# EAGLE design Adafruit NeoPixel 8 Stick (EAGLE 6.5.0)
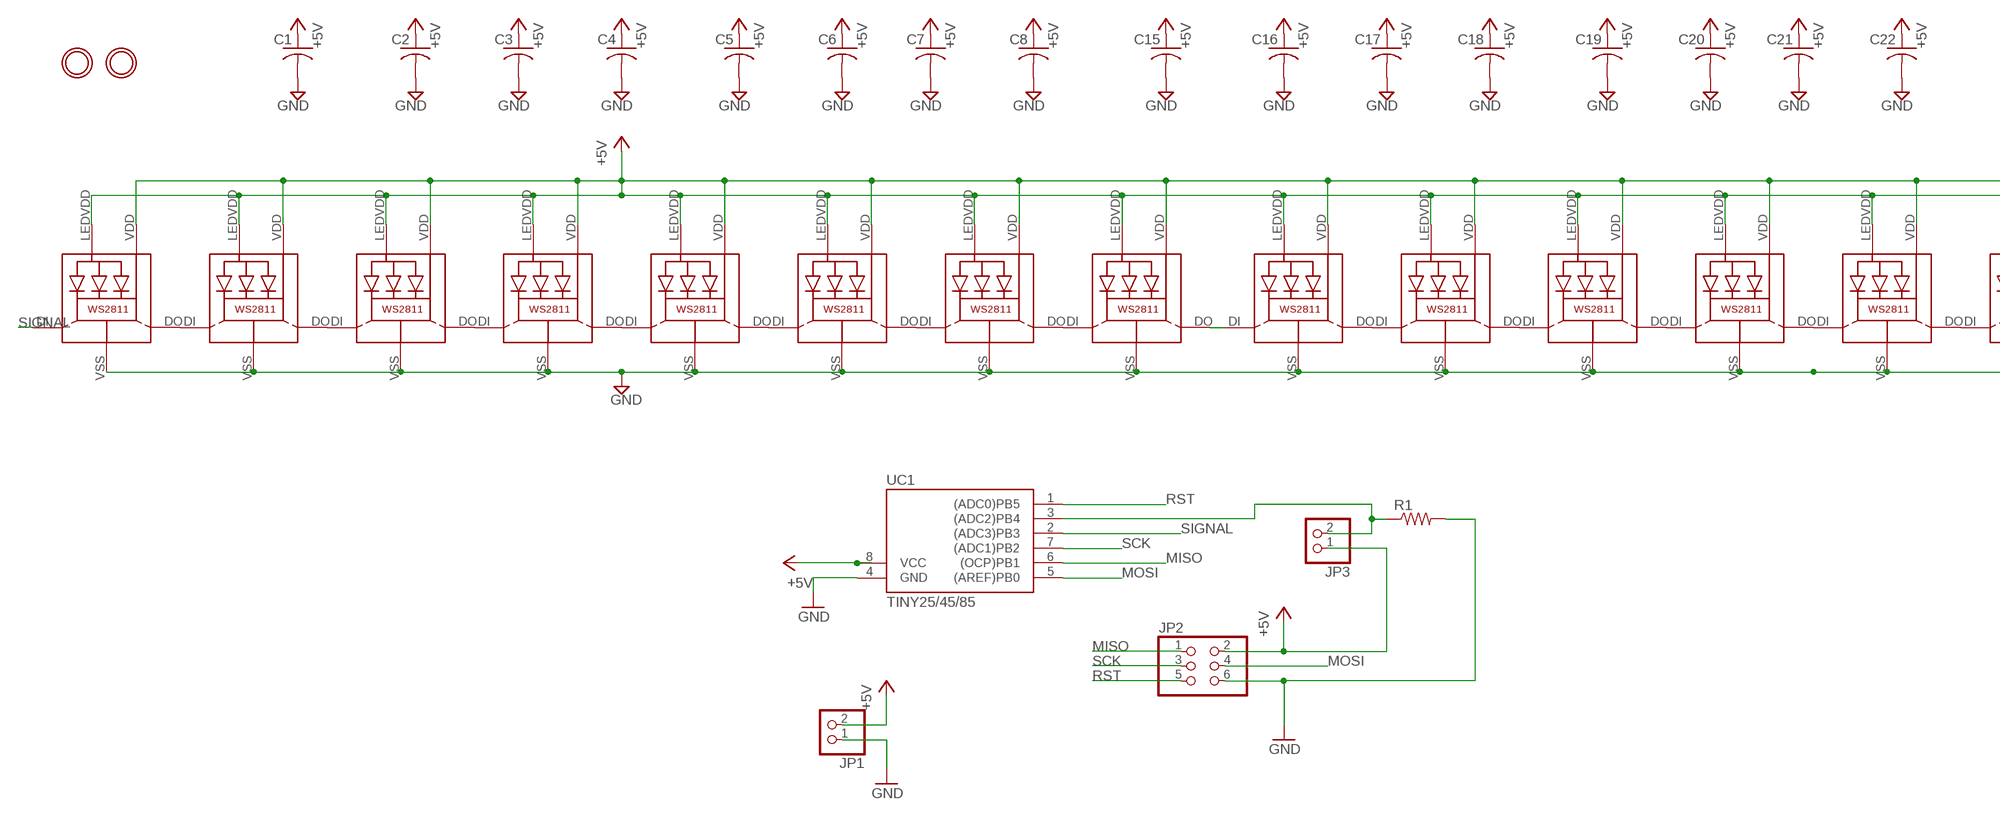
[diagram p0: schematic, sheet 1, part 1 of 2]
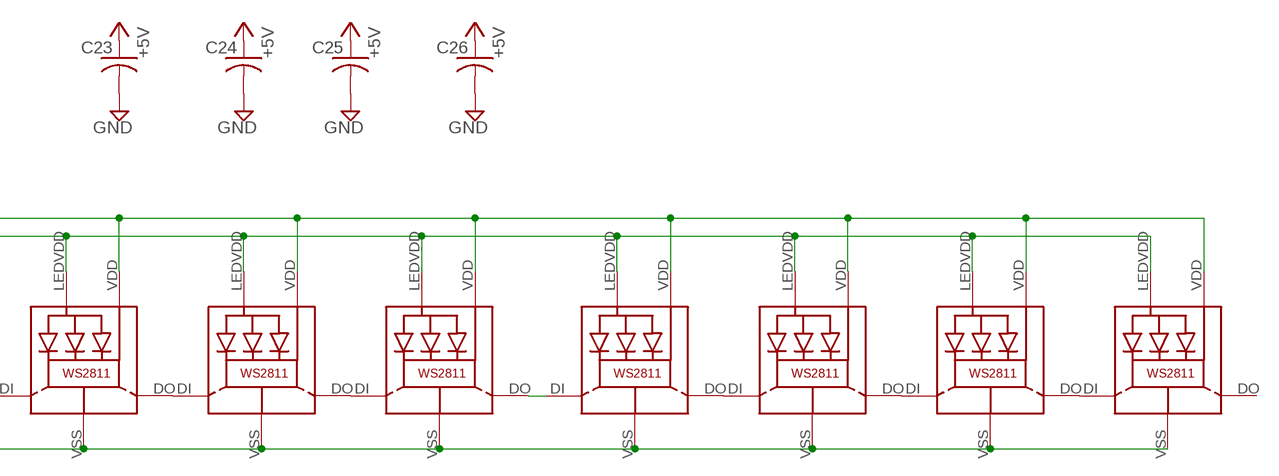
[diagram p1: schematic, sheet 1, part 2 of 2]

## Parts
C1  C-USC0805K  [C0805K]
C2  C-USC0805K  [C0805K]
C3  C-USC0805K  [C0805K]
C4  C-USC0805K  [C0805K]
C5  C-USC0805K  [C0805K]
C6  C-USC0805K  [C0805K]
C7  C-USC0805K  [C0805K]
C8  C-USC0805K  [C0805K]
C15  C-USC0805K  [C0805K]
C16  C-USC0805K  [C0805K]
C17  C-USC0805K  [C0805K]
C18  C-USC0805K  [C0805K]
C19  C-USC0805K  [C0805K]
C20  C-USC0805K  [C0805K]
C21  C-USC0805K  [C0805K]
C22  C-USC0805K  [C0805K]
C23  C-USC0805K  [C0805K]
C24  C-USC0805K  [C0805K]
C25  C-USC0805K  [C0805K]
C26  C-USC0805K  [C0805K]
JP1  PINHD-1X02_2.54  [1X02]
JP2  PINHD-2X03_2.54  [2X03]
JP3  PINHD-1X02_2.54  [1X02]
LED1  WS28115050  [WS28115050]
LED2  WS28115050  [WS28115050]
LED3  WS28115050  [WS28115050]
LED4  WS28115050  [WS28115050]
LED5  WS28115050  [WS28115050]
LED6  WS28115050  [WS28115050]
LED7  WS28115050  [WS28115050]
LED8  WS28115050  [WS28115050]
LED11  WS28115050  [WS28115050]
LED12  WS28115050  [WS28115050]
LED13  WS28115050  [WS28115050]
LED14  WS28115050  [WS28115050]
LED15  WS28115050  [WS28115050]
LED16  WS28115050  [WS28115050]
LED17  WS28115050  [WS28115050]
LED18  WS28115050  [WS28115050]
LED19  WS28115050  [WS28115050]
LED20  WS28115050  [WS28115050]
LED21  WS28115050  [WS28115050]
LED22  WS28115050  [WS28115050]
R1  R-US_M0805  [M0805]
U$2  MOUNTINGHOLE2.0  [MOUNTINGHOLE_2.0_PLATED]
U$3  MOUNTINGHOLE2.0  [MOUNTINGHOLE_2.0_PLATED]
UC1  TINY25/45/85  TINY25-20SU  [SOIC8]

## Nets
+5V: C1.1 C2.1 C3.1 C4.1 C5.1 C6.1 C7.1 C8.1 C15.1 C16.1 C17.1 C18.1 C19.1 C20.1 C21.1 C22.1 C23.1 C24.1 C25.1 C26.1 JP1.2 JP2.2 JP3.1 LED1.LEDVDD LED1.VDD LED2.LEDVDD LED2.VDD LED3.LEDVDD LED3.VDD LED4.LEDVDD LED4.VDD LED5.LEDVDD LED5.VDD LED6.LEDVDD LED6.VDD LED7.LEDVDD LED7.VDD LED8.LEDVDD LED8.VDD LED11.LEDVDD LED11.VDD LED12.LEDVDD LED12.VDD LED13.LEDVDD LED13.VDD LED14.LEDVDD LED14.VDD LED15.LEDVDD LED15.VDD LED16.LEDVDD LED16.VDD LED17.LEDVDD LED17.VDD LED18.LEDVDD LED18.VDD LED19.LEDVDD LED19.VDD LED20.LEDVDD LED20.VDD LED21.LEDVDD LED21.VDD LED22.LEDVDD LED22.VDD UC1.8(VCC)
GND: C1.2 C2.2 C3.2 C4.2 C5.2 C6.2 C7.2 C8.2 C15.2 C16.2 C17.2 C18.2 C19.2 C20.2 C21.2 C22.2 C23.2 C24.2 C25.2 C26.2 JP1.1 JP2.6 LED1.VSS(GND) LED2.VSS(GND) LED3.VSS(GND) LED4.VSS(GND) LED5.VSS(GND) LED6.VSS(GND) LED7.VSS(GND) LED8.VSS(GND) LED11.VSS(GND) LED12.VSS(GND) LED13.VSS(GND) LED14.VSS(GND) LED15.VSS(GND) LED16.VSS(GND) LED17.VSS(GND) LED18.VSS(GND) LED19.VSS(GND) LED20.VSS(GND) LED21.VSS(GND) LED22.VSS(GND) R1.2 UC1.4(GND)
MISO: JP2.1 UC1.6((OCP)PB1)
MOSI: JP2.4 UC1.5((AREF)PB0)
N$1: LED1.DO LED2.DI
N$2: LED2.DO LED3.DI
N$3: LED3.DO LED4.DI
N$4: LED4.DO LED5.DI
N$5: LED5.DO LED6.DI
N$6: LED6.DO LED7.DI
N$7: LED7.DO LED8.DI
N$9: LED11.DO LED12.DI
N$10: JP3.2 R1.1 UC1.3((ADC2)PB4)
N$14: LED12.DO LED13.DI
N$15: LED13.DO LED14.DI
N$16: LED14.DO LED15.DI
N$17: LED15.DO LED16.DI
N$18: LED16.DO LED17.DI
N$19: LED17.DO LED18.DI
N$20: LED19.DO LED20.DI
N$21: LED20.DO LED21.DI
N$22: LED21.DO LED22.DI
N$23: LED8.DO LED11.DI
N$24: LED18.DO LED19.DI
RST: JP2.5 UC1.1((ADC0)PB5)
SCK: JP2.3 UC1.7((ADC1)PB2)
SIGNAL: LED1.DI UC1.2((ADC3)PB3)
Unconnected: LED22.DO

## Library data of the parts
C1-C8 C15-C26 = rcl:C-US: CAPACITOR, American symbol
JP1 JP3 = pinhead-2:PINHD-1X02: PIN HEADER
JP2 = pinhead-2:PINHD-2X03: PIN HEADER
LED1-LED8 LED11-LED22 = microbuilder:WS28115050
R1 = rcl:R-US_: RESISTOR, American symbol
U$2 U$3 = microbuilder:MOUNTINGHOLE: Mounting Hole For #2 screws (0.086"/2.18mm width, 0.094"/2.4mm hole) use 2.5mm
UC1 = avr-5:TINY25

## Board
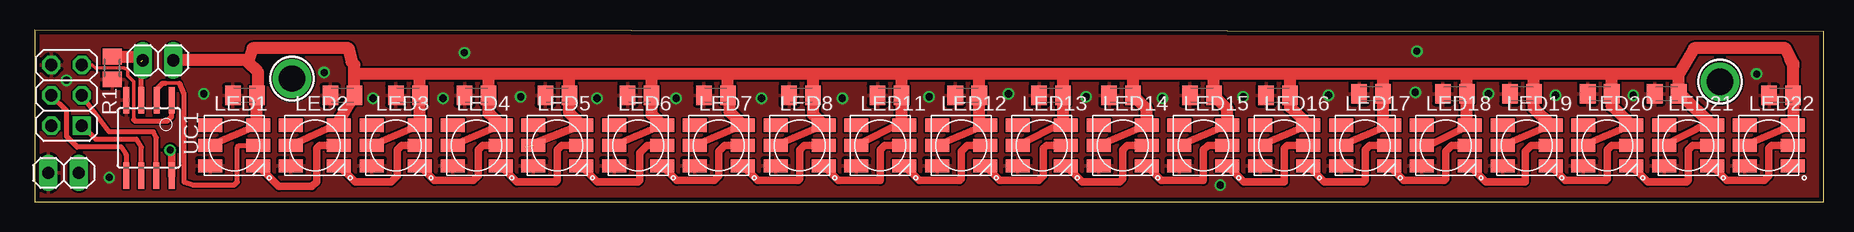
[diagram p2: board, top side]
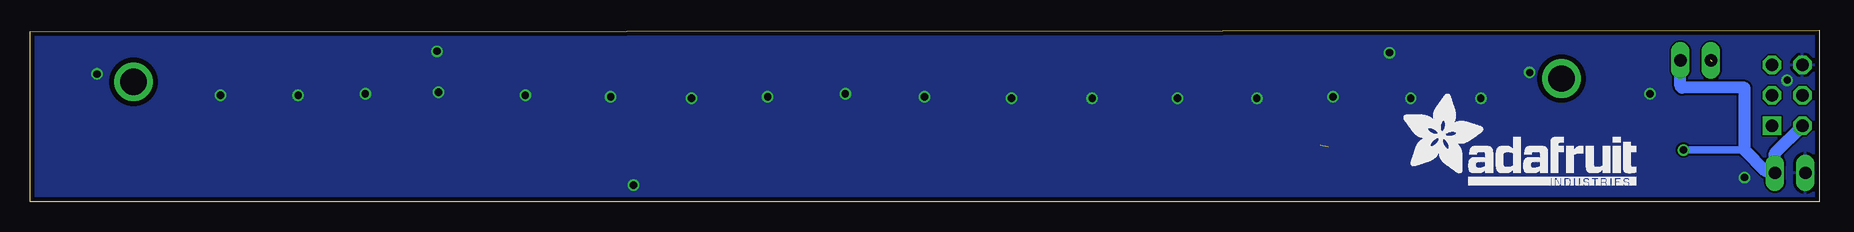
[diagram p3: board, bottom side, seen from below]

Size 149.1 x 14.35 mm. Coordinates in mm from the lower left corner, seen from the top.
Outline: 0,0 149.1,0 149.1,14.22 0,14.35 0,0
Copper layers (1*16): Top 0.0356mm / dielectric 1.5011mm / Bottom 0.0356mm
Design rules "LaenPCBOrder": minimum track width 6mil, minimum drill 13mil, track to track 6mil, track to pad 6mil, pad to pad 6mil, via to via 6mil, smd to smd 6mil, copper to edge 15mil, drill to drill 6mil, minimum pad ring 7mil, minimum via ring 7mil, stop-mask expansion 3mil, vias tented up to drill 0mil, thermal gap 10mil

### Footprints (pad centres in the part's own frame; a part is rotated, then mirrored left to right if it is on the bottom)
C0805K = smd 1.3 x 1.6: 1 -1,0; 2 1,0
1X02 = drill 1.016 long: 1 -1.27,0; 2 1.27,0
2X03 = drill 1.016 square: 1 -2.54,-1.27 | drill 1.016 octagon: 2 -2.54,1.27; 3 0,-1.27; 4 0,1.27; 5 2.54,-1.27; 6 2.54,1.27
WS28115050 = smd 2 x 1.1: DI 2,0; DO 2,-1.7; LEDVDD -2,0; NC -2,1.7; VDD 2,1.7; VSS -2,-1.7
M0805 = smd 1.3 x 1.6: 1 -0.95,0; 2 0.95,0
MOUNTINGHOLE_2.0_PLATED = drill 2.2 pad 3: P$1 0,0
SOIC8 = smd 0.5 x 2.2: 1 -1.905,-3.154; 2 -0.645,-3.154; 3 0.625,-3.154; 4 1.895,-3.154; 5 1.905,3.154; 6 0.635,3.154; 7 -0.635,3.154; 8 -1.905,3.154

### Placement (x,y rotation side)
C1  25.65,8.89 180 top
C2  31.11,8.89 180 top
C3  36.83,8.89 180 top
C4  43.56,8.89 180 top
C5  50.42,8.89 180 top
C6  56.77,8.89 180 top
C7  63.88,8.89 180 top
C8  17.53,8.89 180 top
C15  71.25,8.89 180 top
C16  77.72,8.89 180 top
C17  84.71,8.89 180 top
C18  90.55,8.89 180 top
C19  97.28,8.89 180 top
C20  103.63,8.89 180 top
C21  111.38,9.02 180 top
C22  118.36,9.02 180 top
C23  123.95,9.02 180 top
C24  130.43,9.02 180 top
C25  136.02,9.02 180 top
C26  145.54,8.89 180 top
JP1  2.41,2.41 0 top
JP2  2.67,8.89 90 top
JP3  10.29,11.81 180 top
LED1  16.64,4.7 0 top
LED2  23.37,4.7 0 top
LED3  30.1,4.7 0 top
LED4  36.83,4.7 0 top
LED5  43.56,4.7 0 top
LED6  50.29,4.7 0 top
LED7  57.02,4.7 0 top
LED8  63.75,4.7 0 top
LED11  70.48,4.7 0 top
LED12  77.22,4.7 0 top
LED13  83.95,4.7 0 top
LED14  90.68,4.7 0 top
LED15  97.41,4.7 0 top
LED16  104.14,4.7 0 top
LED17  110.87,4.7 0 top
LED18  117.6,4.7 0 top
LED19  124.33,4.7 0 top
LED20  131.06,4.7 0 top
LED21  137.79,4.7 0 top
LED22  144.53,4.7 0 top
R1  6.48,11.18 270 top
U$1  [ADAFRUIT_TEXT_20MM]  34.8,1.4 0 bottom
U$2  21.46,10.29 0 top
U$3  140.46,10.03 0 top
UC1  9.53,5.33 180 top

### Tracks (layer width: path | path; a pad name or v marks a point on that pad's centre or on a via)
+5V  (via drill 0.6)  (1 unrouted)
  Top 0.61: C8.1 18.64,8.89 | 32.12,6.42 LED3.VDD LED3.LEDVDD | LED11.VDD 72.25,6.64 LED11.LEDVDD | 78.72,6.89 LED12.VDD LED12.LEDVDD | LED13.VDD 85.71,6.64 LED13.LEDVDD | 104.63,7.91 C20.1 | 146.54,6.87 146.94,6.48 146.6,6.48 LED22.VDD LED22.LEDVDD | 112.38,6.89 LED17.VDD LED17.LEDVDD | 119.36,6.64 LED18.VDD 115.95,4.57 LED18.LEDVDD | 124.95,7.78 C23.1 | 131.43,8.03 C24.1 | 139.95,6.48 139.87,6.48 LED21.VDD 139.72,6.48 139.32,6.48 LED21.LEDVDD | LED20.VDD LED20.LEDVDD | LED19.VDD LED19.LEDVDD | LED1.VDD LED1.LEDVDD | LED2.VDD 24.89,6.35 LED2.LEDVDD | LED4.VDD LED4.LEDVDD | LED5.VDD 40.89,4.57 | LED6.VDD LED6.LEDVDD | LED7.VDD LED7.LEDVDD | LED8.VDD LED8.LEDVDD | LED14.LEDVDD LED14.VDD | LED15.LEDVDD LED15.VDD | LED16.LEDVDD LED16.VDD | UC1.8 11.43,4.06 v11.3,4.32
  Top 1.016: 18.64,8.89 18.64,10.83 17.78,11.68 | 17.78,11.68 17.65,11.81 JP3.1 | 26.65,10.79 C1.1 25.26,6.54 LED2.VDD | 26.65,10.79 26.65,11.45 26.42,11.68 26.42,11.81 26.16,12.83 18.16,12.83 17.78,11.68 | 32.12,10.56 C2.1 32.12,6.42 | 32.12,10.56 32,10.67 26.78,10.67 26.65,10.79 | 37.83,10.56 C3.1 37.83,7.4 LED4.VDD | 37.83,10.56 37.72,10.67 32.23,10.67 32.12,10.56 | 44.56,10.56 C4.1 44.56,7.4 LED5.VDD | 44.56,10.56 44.45,10.67 37.94,10.67 37.83,10.56 | 51.44,10.67 51.42,10.65 C5.1 51.42,7.27 LED6.VDD | 51.44,10.67 44.67,10.67 44.56,10.56 | 57.78,10.67 57.78,10.54 57.77,10.53 C6.1 57.77,8.53 57.91,8.38 57.91,7.51 LED7.VDD | 57.78,10.67 51.44,10.67 | 64.9,10.67 64.88,10.65 C7.1 64.88,7.27 LED8.VDD | 64.9,10.67 57.78,10.67 | 72.26,10.67 72.25,10.65 C15.1 72.25,6.64 | 72.26,10.67 64.9,10.67 | 78.74,10.67 78.72,10.65 C16.1 78.72,6.89 | 78.74,10.67 72.26,10.67 | 85.72,10.67 85.72,10.54 85.71,10.53 C17.1 85.71,6.64 | 85.72,10.67 78.74,10.67 | 91.57,10.67 91.57,10.54 91.55,10.53 C18.1 92.68,7.76 LED14.VDD | 91.57,10.67 85.72,10.67 | 98.3,10.54 98.28,10.53 C19.1 99.41,7.76 LED15.VDD | 98.3,10.54 98.3,10.67 91.57,10.67 | 104.65,10.67 104.65,10.54 104.63,10.53 104.63,7.91 LED16.VDD | 104.65,10.67 98.42,10.67 98.3,10.54 | 112.39,10.67 112.38,10.65 C21.1 112.38,6.89 | 112.39,10.67 104.65,10.67 | 119.38,10.67 119.36,10.65 C22.1 119.36,6.64 | 119.38,10.67 112.39,10.67 | 124.84,10.67 124.97,10.54 124.97,10.41 124.95,10.4 124.95,7.78 LED19.VDD | 124.84,10.67 119.38,10.67 | 131.44,10.67 131.43,10.65 131.43,8.03 LED20.VDD | 131.44,10.67 124.84,10.67 | 137.03,10.67 137.02,10.65 C25.1 137.18,9.02 LED21.VDD | 137.03,10.67 131.44,10.67
  Top 1.016: 137.03,10.67 138.3,12.83 145.92,12.83 146.56,11.56 146.3,11.94 146.56,11.43 146.56,11.3 146.54,11.29 C26.1 146.54,6.42 LED22.VDD | LED1.VDD 18.53,6.51 C8.1
  Bottom 0.61: v11.3,4.32 6.22,4.32
  Bottom 1.016: JP2.2 3.68,4.06 JP1.2 4.44,2.54 6.22,4.32 6.22,9.53 11.43,9.53 11.56,9.65 JP3.1
GND  (via drill 0.6)
  other vias: 143.51,10.67 133.22,8.89 98.81,1.4 100.71,8.76 107.82,8.89 115.06,9.14 121.16,9.02 126.75,8.89 93.98,8.64 87.63,8.76 81.15,9.02 74.55,8.76 53.47,8.64 60.58,8.64 67.31,8.64 24.13,10.79 2.67,10.16 34.04,8.64 40.51,8.76 46.86,8.64 28.19,8.64 14.1,9.02 115.19,12.57 6.22,2.03 35.81,12.45
  pour Top: -2.16,33.02 -1.14,-13.46 167,-13.08 165.99,33.4
  pour Bottom: -2.67,33.15 -1.91,-13.72 159.77,-13.59 159,33.27
MISO
  Top 0.406: UC1.6 8.89,4.57 8.51,5.21 5.08,5.21 JP2.1
MOSI
  Top 0.406: JP2.4 2.67,7.62 2.67,5.46 3.56,4.57 7.24,4.57 7.62,3.94 UC1.5
N$1
  Top 0.61: 25.4,4.7 LED2.DI 23.75,4.7 23.5,4.45 23.5,1.65 23.11,1.27 20.37,1.27 LED1.DO
N$2
  Top 0.61: LED3.DI 30.61,4.7 30.23,4.32 30.23,2.16 29.72,1.65 26.72,1.65 LED2.DO
N$3
  Top 0.61: LED4.DI 37.34,4.7 36.96,4.32 36.96,2.16 36.58,1.78 33.32,1.78 LED3.DO
N$4
  Top 0.61: LED5.DI 43.94,4.7 43.56,4.32 43.56,1.78 43.43,1.65 40.18,1.65 LED4.DO
N$5
  Top 0.61: LED6.DI 51.05,4.7 50.42,4.06 50.42,1.78 50.29,1.65 46.91,1.65 LED5.DO
N$6
  Top 0.61: LED7.DI 57.53,4.7 57.02,4.19 57.02,2.16 56.64,1.78 53.51,1.78 LED6.DO
N$7
  Top 0.61: LED8.DI 64.14,4.7 63.75,4.32 63.75,1.91 63.63,1.78 60.24,1.78 LED7.DO
N$9
  Top 0.61: LED12.DI 77.72,4.7 77.22,4.19 77.22,1.91 77.09,1.78 73.71,1.78 LED11.DO
N$10  (1 unrouted)
  Top 0.406: UC1.3 8.9,11.69
  Top 1.016: R1.1 9.02,12.13 JP3.2
N$14
  Top 0.61: LED13.DI 84.33,4.7 84.07,4.45 84.07,2.16 83.69,1.78 80.44,1.78 LED12.DO
N$15
  Top 0.61: LED14.DI 91.06,4.7 90.68,4.32 90.68,1.91 90.42,1.65 87.3,1.65 LED13.DO
N$16
  Top 0.61: LED15.DI 97.79,4.7 97.41,4.32 97.41,1.78 93.9,1.78 LED14.DO
N$17
  Top 0.61: LED16.DI 104.39,4.7 104.14,4.45 104.14,1.65 100.76,1.65 LED15.DO
N$18
  Top 0.61: LED17.DI 111.25,4.7 110.87,4.32 110.87,1.78 110.74,1.65 107.49,1.65 LED16.DO
N$19
  Top 0.61: LED18.DI 118.11,4.7 117.6,4.19 117.6,1.91 117.47,1.78 114.09,1.78 LED17.DO
N$20
  Top 0.61: LED20.DI 131.44,4.7 131.06,4.32 131.06,1.91 130.94,1.78 127.55,1.78 LED19.DO
N$21
  Top 0.61: LED21.DI 138.18,4.7 137.79,4.32 137.79,1.78 137.67,1.65 134.41,1.65 LED20.DO
N$22
  Top 0.61: LED22.DI 144.78,4.7 144.53,4.45 144.53,2.16 144.15,1.78 141.02,1.78 LED21.DO
N$23
  Top 0.61: LED11.DI 70.87,4.7 70.48,4.32 70.48,1.78 66.97,1.78 LED8.DO
N$24
  Top 0.61: LED19.DI 124.71,4.7 124.21,4.19 124.21,1.65 120.95,1.65 LED18.DO
RST
  Top 0.254: 7.49,11.18 5.08,11.18
  Top 0.305: 7.49,11.18 7.75,11.05 7.75,10.54 8.25,10.03 8.25,6.86 | 5.08,11.18 4.83,11.43 JP2.5
  Top 0.406: 8.25,6.86 8.38,6.73 11.05,6.73 11.43,7.11 UC1.1
SCK
  Top 0.406: UC1.7 10.16,5.33 9.91,5.84 6.22,5.84 JP2.3
SIGNAL
  Top 0.305: 10.92,9.91 12.06,9.91
  Top 0.406: UC1.2 10.17,9.41 10.67,9.91 10.92,9.91 | LED1.DI 17.02,4.7 16.89,4.57 16.89,1.65 16.64,1.4 13.21,1.4 12.45,1.65 12.45,9.02 12.06,9.91